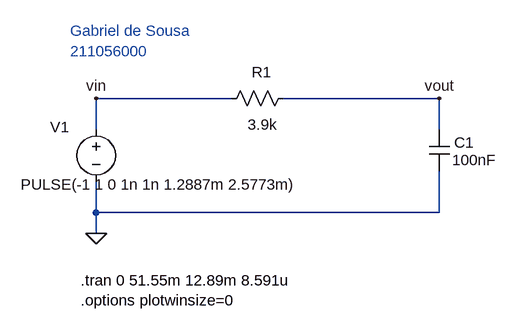
[diagram p0: schematic item_6.asc]
item_6.asc, the LTspice schematic file:
Version 4.1
SHEET 1 880 680
WIRE 336 32 128 32
WIRE 656 32 416 32
WIRE 128 80 128 32
WIRE 656 80 656 32
WIRE 128 208 128 160
WIRE 656 208 656 144
WIRE 656 208 128 208
WIRE 128 240 128 208
FLAG 128 240 0
FLAG 128 32 vin
FLAG 656 32 vout
SYMBOL voltage 128 64 R0
WINDOW 0 -71 12 Left 2
WINDOW 3 -116 101 Left 2
WINDOW 123 -82 78 Left 0
WINDOW 39 0 0 Left 0
SYMATTR InstName V1
SYMATTR Value PULSE(-1 1 0 1n 1n 1.2887m 2.5773m)
SYMBOL res 432 16 R90
WINDOW 0 -9 49 VBottom 2
WINDOW 3 41 48 VTop 2
SYMATTR InstName R1
SYMATTR Value 3.9k
SYMBOL cap 640 80 R0
WINDOW 0 39 20 Left 2
WINDOW 3 36 47 Left 2
SYMATTR InstName C1
SYMATTR Value 100nF
TEXT 104 312 Left 2 !.tran 0 51.55m 12.89m 8.591u\n.options plotwinsize=0
TEXT 88 -72 Left 2 ;Gabriel de Sousa\n211056000

The netlist it stands for:
* item_6.asc
V1 vin 0 PULSE(-1 1 0 1n 1n 1.2887m 2.5773m)
R1 vout vin 3.9k
C1 vout 0 100nF
.tran 0 51.55m 12.89m 8.591u
.options plotwinsize=0
* Gabriel de Sousa
* 211056000
.backanno
.end